# Altium schematic sheet Brduino-Main.SchDoc: BRDUINO
size A3; Organization: TDK Micronas; DocumentNumber: tbd; Revision: 0.00.001; SheetNumber: 1; SheetTotal: 4; Date: 8/14/2020; DrawnBy: Moerz; Engineer: Moerz
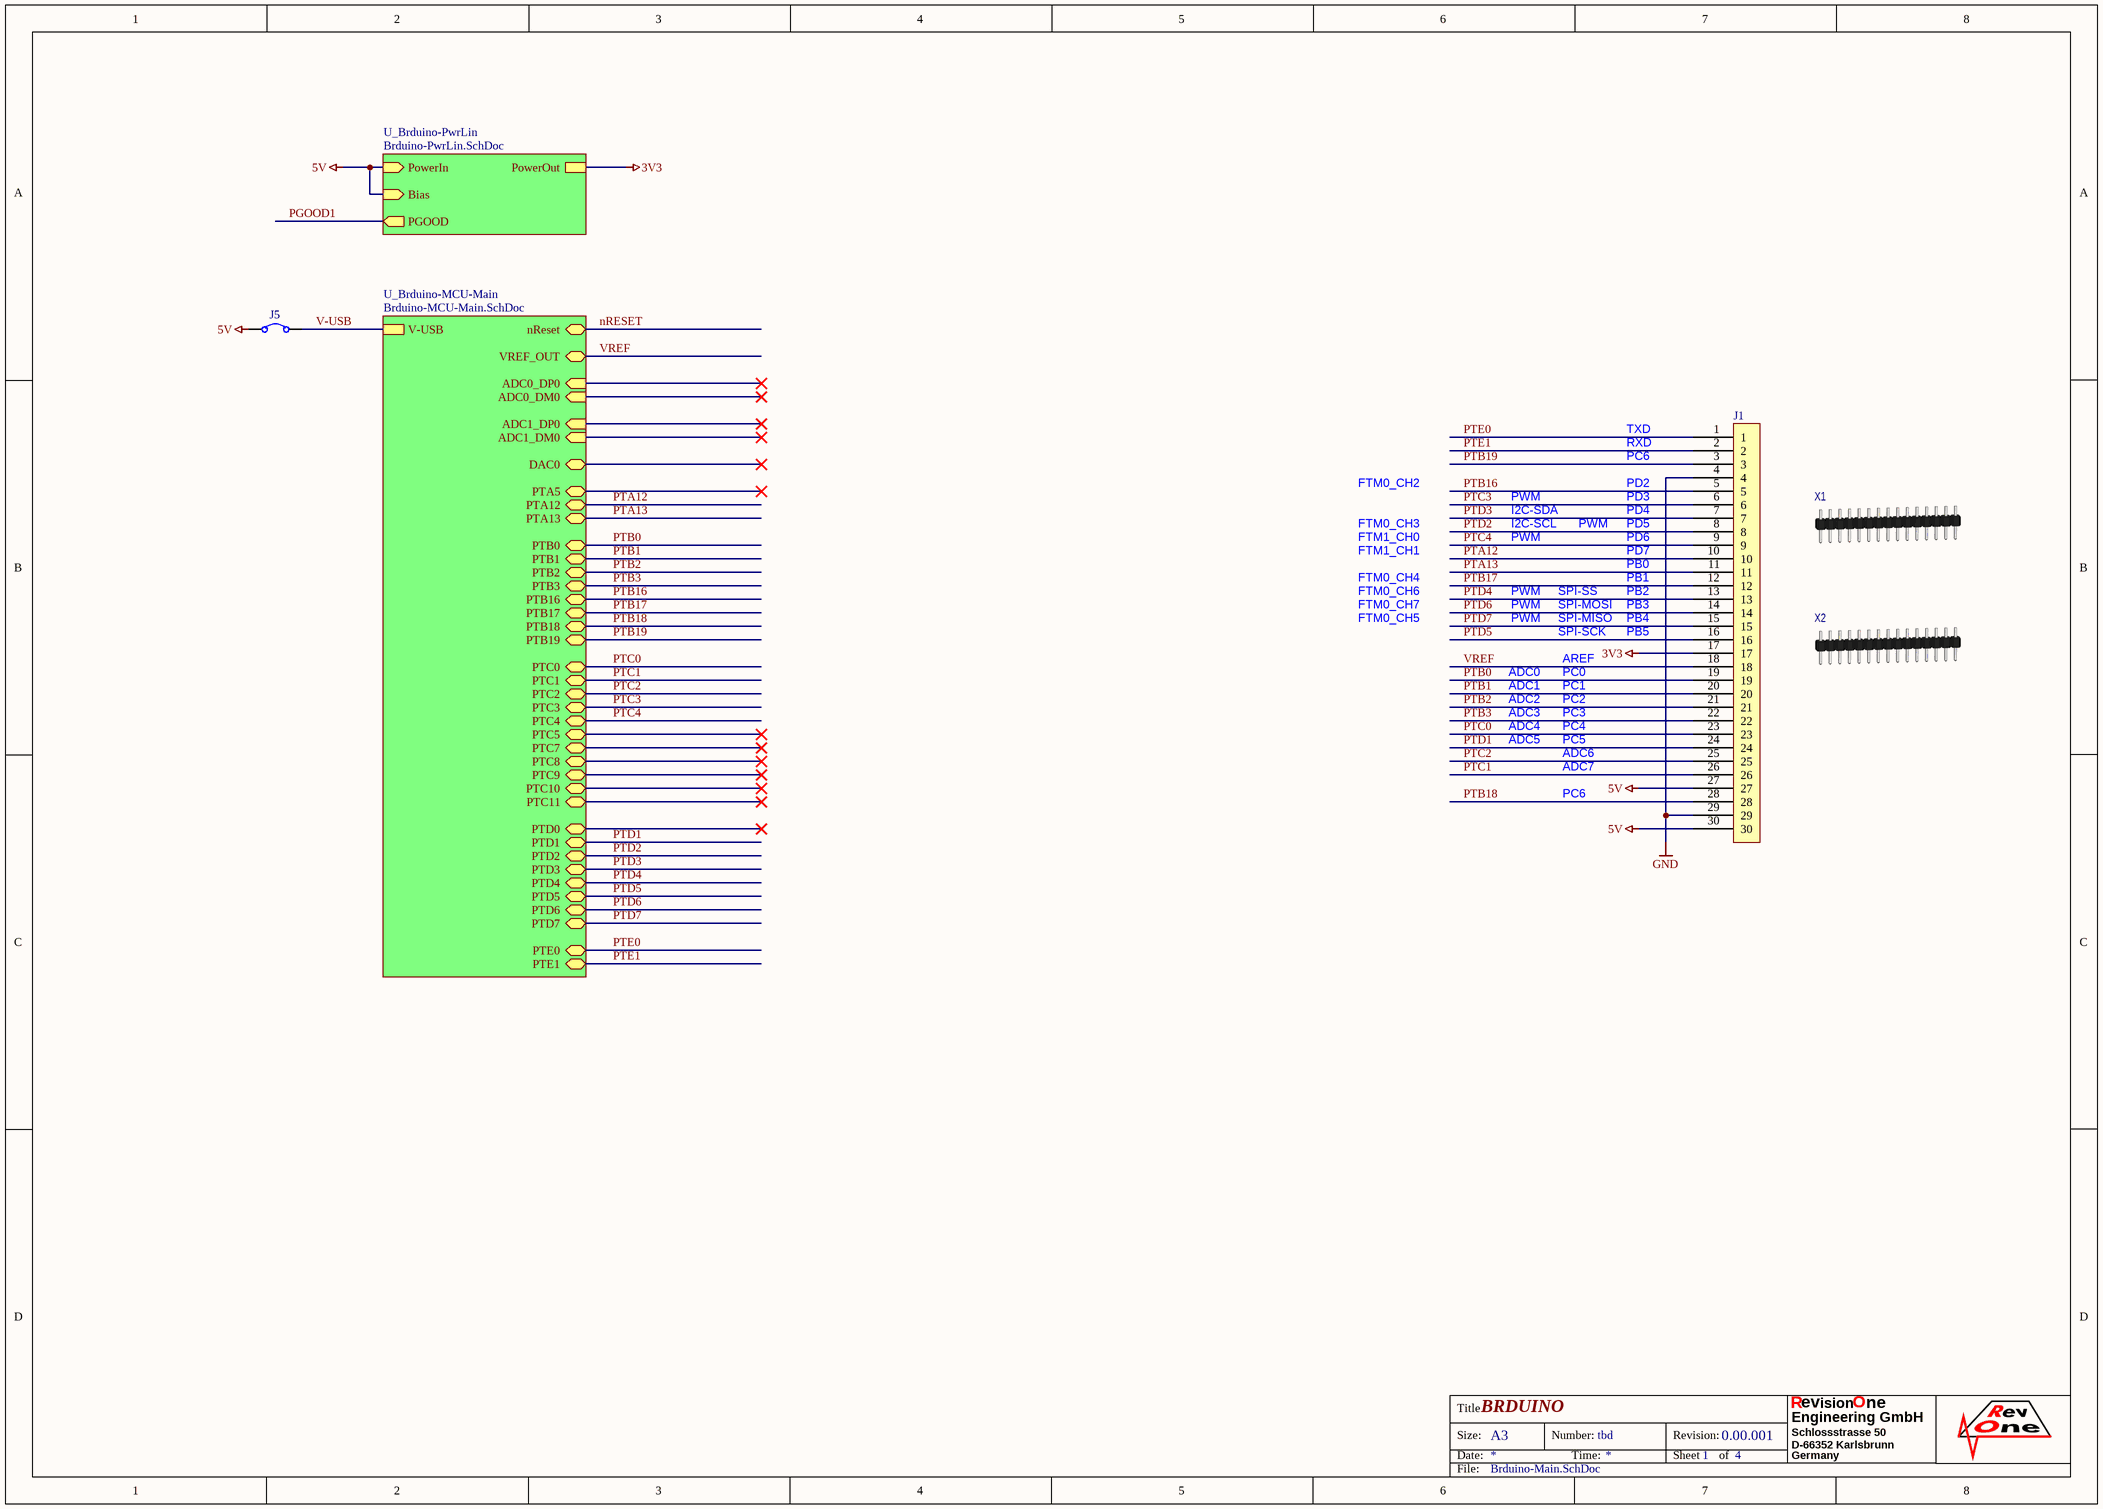
[diagram p0: Brduino-Main.SchDoc]

## Parts
J1  X  [ARDUINO-NANO]  (value not drawn)  (no BOM)
J5  R  [JumperSMD]  (value not drawn)
X1  X  (value not drawn)  (mechanical)
X2  X  (value not drawn)  (mechanical)

## Sub-sheets
U_Brduino-MCU-Main = Brduino-MCU-Main.SchDoc: PTD1 (bidir), PTC9 (bidir), PTA12 (bidir), PTB0 (bidir), PTD2 (bidir), PTD5 (bidir), ADC0_DP0 (in), PTA5 (bidir), PTC3 (bidir), DAC0 (bidir), PTC2 (bidir), PTC7 (bidir), PTD7 (bidir), PTC0 (bidir), PTC5 (bidir), ADC1_DP0 (in), PTB1 (bidir), PTB18 (bidir), PTD4 (bidir), PTB19 (bidir), PTB16 (bidir), nReset (bidir), PTB2 (bidir), ADC0_DM0 (in), PTD6 (bidir), VREF_OUT (bidir), PTE0 (bidir), PTD0 (bidir), PTC11 (bidir), PTE1 (bidir), PTC1 (bidir), PTC10 (bidir), PTC4 (bidir), PTB17 (bidir), PTB3 (bidir), ADC1_DM0 (in), PTC8 (bidir), PTA13 (bidir), PTD3 (bidir), V-USB
U_Brduino-PwrLin = Brduino-PwrLin.SchDoc: PowerOut, PowerIn (in), Bias (in), PGOOD (out)

## Nets
3V3: J1.17 ; sheet U_Brduino-PwrLin/PowerOut
5V: J1.27 J1.30 J5.1 ; sheet U_Brduino-PwrLin/PowerIn, sheet U_Brduino-PwrLin/Bias
GND: J1.4 J1.29
nRESET: sheet U_Brduino-MCU-Main/nReset
PGOOD1: sheet U_Brduino-PwrLin/PGOOD
PTA12: J1.10 ; sheet U_Brduino-MCU-Main/PTA12
PTA13: J1.11 ; sheet U_Brduino-MCU-Main/PTA13
PTB0: J1.19 ; sheet U_Brduino-MCU-Main/PTB0
PTB1: J1.20 ; sheet U_Brduino-MCU-Main/PTB1
PTB2: J1.21 ; sheet U_Brduino-MCU-Main/PTB2
PTB3: J1.22 ; sheet U_Brduino-MCU-Main/PTB3
PTB16: J1.5 ; sheet U_Brduino-MCU-Main/PTB16
PTB17: J1.12 ; sheet U_Brduino-MCU-Main/PTB17
PTB18: J1.28 ; sheet U_Brduino-MCU-Main/PTB18
PTB19: J1.3 ; sheet U_Brduino-MCU-Main/PTB19
PTC0: J1.23 ; sheet U_Brduino-MCU-Main/PTC0
PTC1: J1.26 ; sheet U_Brduino-MCU-Main/PTC1
PTC2: J1.25 ; sheet U_Brduino-MCU-Main/PTC2
PTC3: J1.6 ; sheet U_Brduino-MCU-Main/PTC3
PTC4: J1.9 ; sheet U_Brduino-MCU-Main/PTC4
PTD1: J1.24 ; sheet U_Brduino-MCU-Main/PTD1
PTD2: J1.8 ; sheet U_Brduino-MCU-Main/PTD2
PTD3: J1.7 ; sheet U_Brduino-MCU-Main/PTD3
PTD4: J1.13 ; sheet U_Brduino-MCU-Main/PTD4
PTD5: J1.16 ; sheet U_Brduino-MCU-Main/PTD5
PTD6: J1.14 ; sheet U_Brduino-MCU-Main/PTD6
PTD7: J1.15 ; sheet U_Brduino-MCU-Main/PTD7
PTE0: J1.1 ; sheet U_Brduino-MCU-Main/PTE0
PTE1: J1.2 ; sheet U_Brduino-MCU-Main/PTE1
V-USB: J5.2 ; sheet U_Brduino-MCU-Main/V-USB
VREF: J1.18 ; sheet U_Brduino-MCU-Main/VREF_OUT

## Notes on the sheet
- TXD
- RXD
- FTM0_CH2
- PWM
- I2C-SDA
- PC6
- PD2
- PD3
- PD4
- FTM0_CH3
- FTM1_CH0
- FTM1_CH1
- FTM0_CH4
- I2C-SCL
- PD5
- PD6
- PD7
- PB0
- PB1
- FTM0_CH6
- FTM0_CH7
- FTM0_CH5
- SPI-SS
- SPI-MOSI
- SPI-MISO
- SPI-SCK
- PB2
- PB3
- PB4
- PB5
- ADC0
- ADC1
- ADC2
- ADC3
- PC0
- PC1
- PC2
- PC3
- AREF
- ADC4
- ADC5
- PC4
- PC5
- ADC6
- ADC7
- Title
- Size:
- Date:
- A3
- Number:
- Time:
- Revision:
- Sheet
- of
- R
- Schlossstrasse 50
- D-66352 Karlsbrunn
- Germany
- Engineering GmbH
- ev
- ision
- O
- ne
- File:

## Library data of the parts
J1 = ARDUINO-NANO-CON: 01. Distributor: DigiKey
J5 = Jumper: RES SMD 0 OHM JUMPER 1/10W 0603; 04. Manufacturer: Yageo; 05. Manufacturer PN: RC0603JR-070RL; POPULATED: yes; 03. Unit Price: 0.08; Value: 0R; 01. Distributor: DigiKey; 02. distributor PN: 311-0.0GRDKR-ND
X1 X2 = TSW-115-08-F-S: CONN HEADER VERT 15POS 2.54MM; 04. Manufacturer: Samtec Inc.; 05. Manufacturer PN: HTSW-115-08-F-S; 03. Unit Price: 1.03; POPULATED: yes; 01. Distributor: DigiKey; 02. distributor PN: HTSW-115-08-F-S-ND